# EAGLE schematic activity_monitor_v2 (EAGLE 6.4)
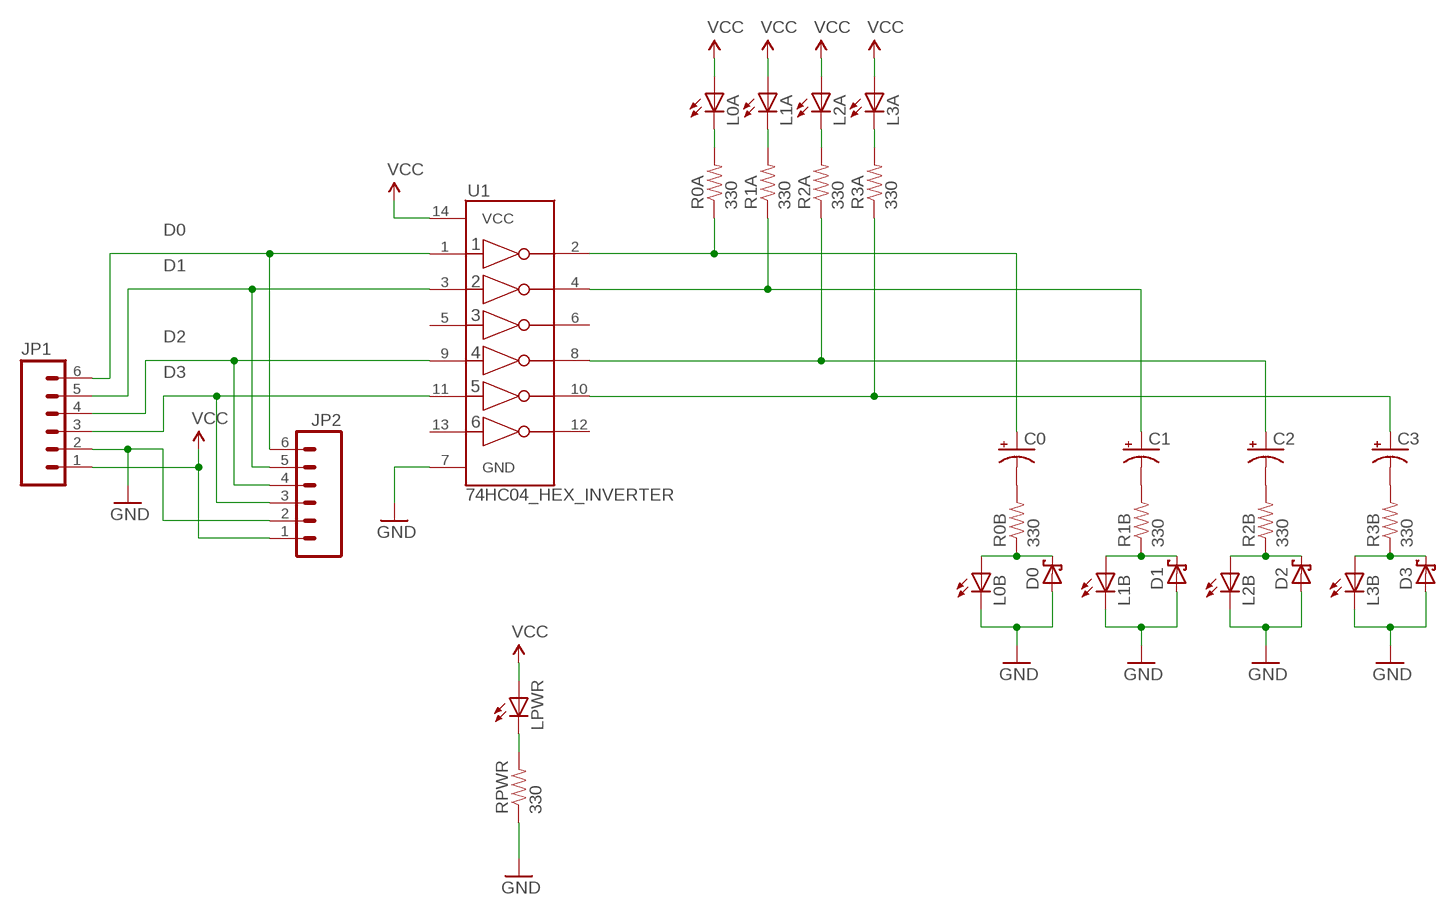
[diagram p0: schematic, sheet 1]

## Parts
C0  CAP_POLPTH2  [CPOL-RADIAL-10UF-25V]
C1  CAP_POLPTH2  [CPOL-RADIAL-10UF-25V]
C2  CAP_POLPTH2  [CPOL-RADIAL-10UF-25V]
C3  CAP_POLPTH2  [CPOL-RADIAL-10UF-25V]
D0  SCHOTTKY-DIODEDO35-7  [DO35-7]
D1  SCHOTTKY-DIODEDO35-7  [DO35-7]
D2  SCHOTTKY-DIODEDO35-7  [DO35-7]
D3  SCHOTTKY-DIODEDO35-7  [DO35-7]
JP1  M06SIP  [1X06]
JP2  M06SIP  [1X06]
L0A  LED3MM  [LED3MM]
L0B  LED3MM  [LED3MM]
L1A  LED3MM  [LED3MM]
L1B  LED3MM  [LED3MM]
L2A  LED3MM  [LED3MM]
L2B  LED3MM  [LED3MM]
L3A  LED3MM  [LED3MM]
L3B  LED3MM  [LED3MM]
LPWR  LED3MM  [LED3MM]
R0A  330  RESISTORPTH-1/4W  [AXIAL-0.4]
R0B  330  RESISTORPTH-1/4W  [AXIAL-0.4]
R1A  330  RESISTORPTH-1/4W  [AXIAL-0.4]
R1B  330  RESISTORPTH-1/4W  [AXIAL-0.4]
R2A  330  RESISTORPTH-1/4W  [AXIAL-0.4]
R2B  330  RESISTORPTH-1/4W  [AXIAL-0.4]
R3A  330  RESISTORPTH-1/4W  [AXIAL-0.4]
R3B  330  RESISTORPTH-1/4W  [AXIAL-0.4]
RPWR  330  RESISTORPTH-1/4W  [AXIAL-0.4]
U1  74HC04_HEX_INVERTER  [DIL14]

## Nets
D0: JP1.6 JP2.6 U1.1(1A)
D1: JP1.5 JP2.5 U1.3(2A)
D2: JP1.4 JP2.4 U1.9(4A)
D3: JP1.3 JP2.3 U1.11(5A)
GND: D0.A D1.A D2.A D3.A JP1.2 JP2.2 L0B.K(C) L1B.K(C) L2B.K(C) L3B.K(C) RPWR.P$1 U1.7(GND)
N$1: C0.1(+) R0A.P$1 U1.2(1Y)
N$2: C1.1(+) R1A.P$1 U1.4(2Y)
N$3: C2.1(+) R2A.P$1 U1.8(4Y)
N$4: C3.1(+) R3A.P$1 U1.10(5Y)
N$5: L0A.K(C) R0A.P$2
N$6: L1A.K(C) R1A.P$2
N$7: L2A.K(C) R2A.P$2
N$8: L3A.K(C) R3A.P$2
N$9: C0.2(-) R0B.P$2
N$10: D0.C L0B.A R0B.P$1
N$12: C1.2(-) R1B.P$2
N$13: LPWR.K(C) RPWR.P$2
N$15: C2.2(-) R2B.P$2
N$18: C3.2(-) R3B.P$2
R1B: D1.C L1B.A R1B.P$1
R2B: D2.C L2B.A R2B.P$1
R3B: D3.C L3B.A R3B.P$1
VCC: JP1.1 JP2.1 L0A.A L1A.A L2A.A L3A.A LPWR.A U1.14(VCC)
Unconnected: U1.5(3A) U1.6(3Y) U1.12(6Y) U1.13(6A)

## Library data of the parts
C0 C1-C3 = SparkFun-Capacitors:CAP_POL: Capacitor Polarized These are standard SMD and PTH capacitors. Normally 10uF, 47uF, and 100uF in electrolytic and tantalum varieties. Always verify the external diameter of the through hole cap, it varies with capacity, voltage, and manufacturer. The EIA devices should be standard.
D0 D1-D3 = diode:SCHOTTKY-DIODE: Schottky Diode
JP1 JP2 = SparkFun-Connectors:M06: Header 6 Standard 6-pin 0.1" header. Use with straight break away headers (SKU : PRT-00116), right angle break away headers (PRT-00553), swiss pins (PRT-00743), machine pins (PRT-00117), and female headers (PRT-00115). Molex polarized connector foot print use with SKU : PRT-08094 with associated crimp pins and housings. NOTES ON THE VARIANTS LOCK and LOCK_LONGPADS... This footprint was designed to help hold the alignment of a through-hole component (i.e. 6-pin header) while soldering it into place. You may notice that each hole has been shifted either up or down by 0.005 of an inch from it's more standard position (which is a perfectly straight line). This slight alteration caused the pins (the squares in the middle) to touch the edges of the holes. Because they are alternating, it causes a "brace" to hold the component in place. 0.005 has proven to be the perfect amount of "off-center" position when using our standard breakaway headers. Although looks a little odd when you look at the bare footprint, once you have a header in there, the alteration is very hard to notice. Also,if you push a header all the way into place, it is covered up entirely on the bottom side. This idea of altering the position of holes to aid alignment will be further integrated into the Sparkfun Library for other footprints. It can help hold any component with 3 or more connection pins.
L0A L0B L1A L1B L2A L2B L3A L3B LPWR = SparkFun-LED:LED: LEDs Standard schematic elements and footprints for 5mm, 3mm, 1206, and 0603 sized LEDs. 5mm - Spark Fun Electronics SKU : COM-00529 (and others)
R0A R0B R1A R1B R2A R2B R3A R3B RPWR = SparkFun-Passives:RESISTOR: Resistor Basic schematic elements and footprints for 0603, 1206, and PTH resistors.
U1 = SparkFun-DigitalIC:74HC04_HEX_INVERTER: 74HC04 Hex Inverter

## Net classes
0 default: width 0.254 mm, clearance 0.254 mm